# Altium schematic sheet ESP.SchDoc
size A; SheetNumber: 6; SheetTotal: 8
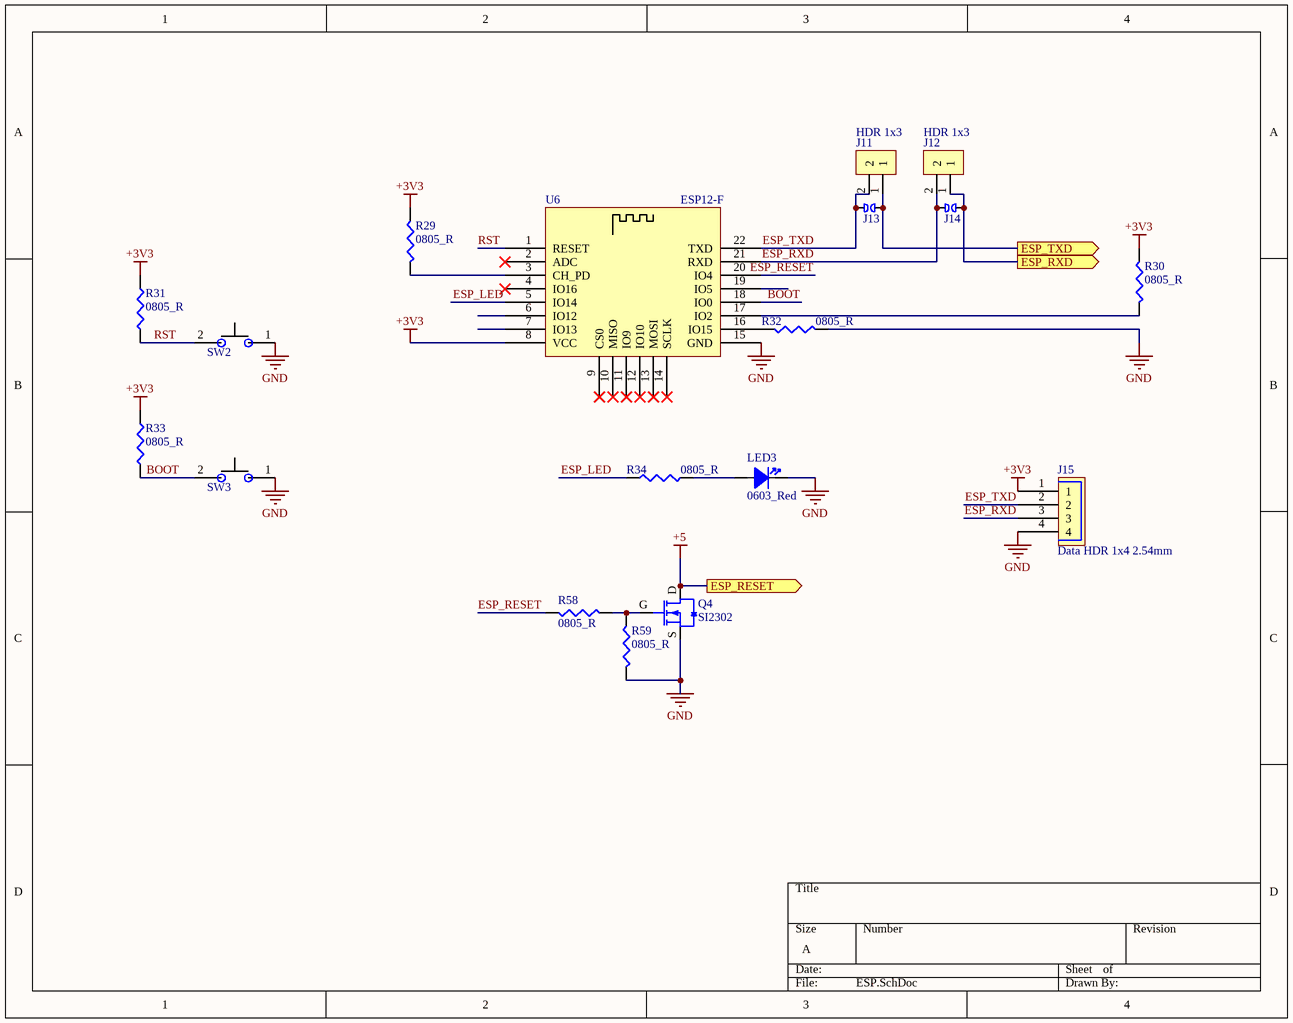
[diagram p0: ESP.SchDoc]

## Parts
J11  HDR 1x3  [HDR 1x2 2.54mm]
J12  HDR 1x3  [HDR 1x2 2.54mm]
J13  Jumper Pads  [JMP]  (value not drawn)
J14  Jumper Pads  [JMP]  (value not drawn)
J15  Data HDR 1x4 2.54mm  [DHDR_1x4_2.54mm]
LED3  0603_Red  [0603_LED]
Q4  SI2302  [SO-23 - MOSFET]
R29  0805_R  [R0805]
R30  0805_R  [R0805]
R31  0805_R  [R0805]
R32  0805_R  [R0805]
R33  0805_R  [R0805]
R34  0805_R  [R0805]
R58  0805_R  [R0805]
R59  0805_R  [R0805]
SW2  2*3*4 SMD Button 2_Pads  [2padSMD- 2*3*4]  (value not drawn)
SW3  2*3*4 SMD Button 2_Pads  [2padSMD- 2*3*4]  (value not drawn)
U6  ESP12-F  [ESP12-F]

## Ports
ESP_RESET (out), ESP_RXD (out), ESP_TXD (out)

## Nets
+3V3: J15.1 R29.2 R30.2 R31.2 R33.2 U6.8(VCC)
+5: Q4.D ; port ESP_RESET
GND: J15.4 LED3.2(Cathode) Q4.S R32.1 R59.1 SW2.1 SW3.1 U6.15(GND)
BOOT: R33.1 SW3.2 U6.18(IO0)
ESP_LED: R34.1 U6.5(IO14)
ESP_RESET: R58.1 U6.20(IO4)
ESP_RXD: J12.2 J14.1 J15.3 U6.21(RXD)
ESP_RXD: J12.1 J14.2 ; port ESP_RXD  [a separate net that carries the same name]
ESP_TXD: J11.2 J13.1 J15.2 U6.22(TXD)
ESP_TXD: J11.1 J13.2 ; port ESP_TXD  [a separate net that carries the same name]
RST: R31.1 SW2.2 U6.1(RESET)
NetLED3_1: LED3.1(Anode) R34.2
NetQ4_G: Q4.G R58.2 R59.2
NetR29_1: R29.1 U6.3(CH_PD)
NetR30_1: R30.1 U6.17(IO2)
NetR32_2: R32.2 U6.16(IO15)

Not connected (* = marked no-connect by the designer): U6 2(ADC)* 4(IO16)* 6(IO12) 7(IO13) 9(CS0)* 10(MISO)* 11(IO9)* 12(IO10)* 13(MOSI)* 14(SCLK)* 19(IO5)

## Library data of the parts
J11 J12 = HDR 1x2: 1x3 Male Header 2.54 mm pitch
J15 = 4-Pin Data Connector: MTA-100 Series, 2.54mm Pitch 4 Way 1 RowStraight PCB Header, Solder Term, 5A; Manufacturer 1: TE Connectivity; Manufacturer Part Number 1: 2-644861-4; Underplate Material: Nickel; Number of Contacts: 4; Connector Type: Plug,Header,Pin; Voltage Rating: 250V; Gender: Male; Shrouded: Yes (With); PCB Mount Retention: Without; PCB Mounting Orientation: Vertical; Contact Resistance: 6mR; Backwall/Post Interruptions: No (Without); Connector System: Wire-to-Board; Contact Post Length: 3.56mm; Plating Thickness: 6.35um; PCB Thickness: 0.063inch; Approvals: CSA; Supplier 1: Digi-Key; Stock 1: 18767; Pricing 1: 1=0.79000, 10=0.74100, 100=0.56790, 500=0.49380, 1000=0.40739, 5000=0.35801, 10000=0.33332 (USD); RoHS: Yes; Mount: Through Hole; Housing Color: Black; Color: Black; Contact Material: Copper Alloy; Contact Plating: Tin,Matte; Housing Material: Polyester; Contact Shape: Square; Min Operating Temperature: -67°C; Max Operating Temperature: 221°C; Termination: Solder; Number of Rows: 1; Contact Gender: Male; Number of Positions: 4; Package Quantity: 500; Packaging: Loose Piece; Current Rating: 5A; Voltage Rating (AC): 250V; Mating Alignment: Yes (With); Orientation: Straight; Fastening Type: Friction; Max Voltage Rating (AC): 250V; Contact Current Rating: 5A; Contact Retention: No (Without); Mating Retention: Yes (With); PCB Mount Alignment: No (Without); Sealable: No (Without); Strain Relief: No (Without); Contact Style: Straight; Length: 12.29mm; Height: 10.41mm; Pitch: 2.54mm; Contact Mating Length: 5.1mm; Depth: 7.95mm; Tail Length: 3.56mm; Radiation Hardening: No; Flammability Rating: UL94 V-0; ELV: Compliant; Lead Free: Lead Free; REACH SVHC: Unknown; ComponentLink1URL: https://datasheet.ciiva.com/7800/1651878-7800290.pdf?src-supplier=Element14; ComponentLink1Description: https://datasheet.ciiva.com/7800/1651878-7800290.pdf?src-supplier=Element14; ComponentLink2URL: https://datasheet.ciiva.com/15175/getdatasheetpartid-36841-15175492.pdf?src-supplier=Verical; ComponentLink2Description: https://datasheet.ciiva.com/15175/getdatasheetpartid-36841-15175492.pdf?src-supplier=Verical; ComponentLink3URL: https://datasheet.ciiva.com/11759/0900766b80f915a0-11759930.pdf?src-supplier=RSComponents; ComponentLink3Description: https://datasheet.ciiva.com/11759/0900766b80f915a0-11759930.pdf?src-supplier=RSComponents; ComponentLink4URL: https://datasheet.ciiva.com/714/eng-cd-644861-n-basefilename-714593.pdf?src-supplier=Digi-Key; ComponentLink4Description: https://datasheet.ciiva.com/714/eng-cd-644861-n-basefilename-714593.pdf?src-supplier=Digi-Key; ComponentLink5URL: https://datasheet.ciiva.com/16684/eng-ds-82056-mta-0608-16684709.pdf?src-supplier=Avnet+Europe; ComponentLink5Description: https://datasheet.ciiva.com/16684/eng-ds-82056-mta-0608-16684709.pdf?src-supplier=Avnet+Europe; ComponentLink6URL: https://datasheet.ciiva.com/16497/eng-ds-82056-mta-0608-16497871.pdf?src-supplier=Avnet+Asia; ComponentLink6Description: https://datasheet.ciiva.com/16497/eng-ds-82056-mta-0608-16497871.pdf?src-supplier=Avnet+Asia; Supplier Part Number 1: A30933-ND
LED3 = 0603LED
Q4 = SI2302: SI2302 A2SHB 20V 2.5A 0.9W 40mΩ@4.5V,2.5A N Channel SOT-23 MOSFET SMD
R29-R34 R58 R59 = 0805 Resistor